# Altium project atfc.PrjPcb (part 2 of 2)

## Sheet Regulators.SchDoc: Power: Regulators
size A4; Engineer: Samer Kilani; DocumentNumber: 8; SheetNumber: 8; SheetTotal: 9
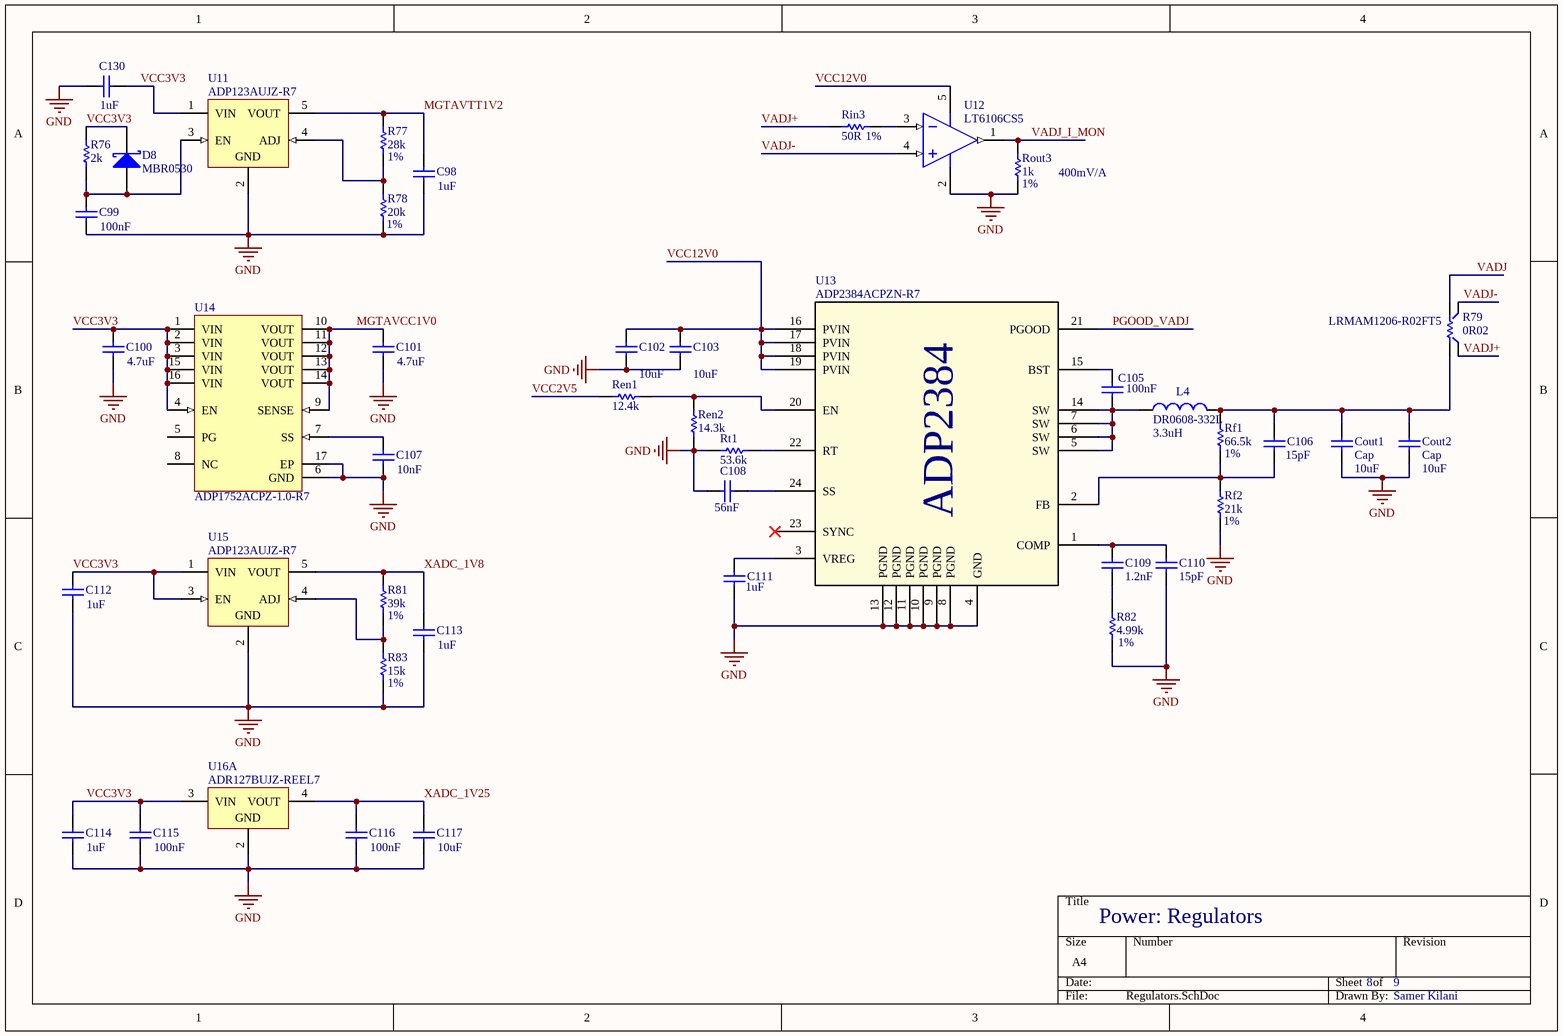
[diagram p7: Regulators.SchDoc]

### Parts
C98  value 1uF  [C0603]
C99  value 100nF  [C0402]
C100  value 4.7uF  [C0603]
C101  value 4.7uF  [C0603]
C102  value 10uF  [C0805]
C103  value 10uF  [C0805]
C105  value 100nF  [C0402]  (hidden comment: Cap)
C106  value 15pF  [C0402]
C107  value 10nF  [C0603]
C108  value 56nF  [C0402]
C109  value 1.2nF  [C0402]
C110  value 15pF  [C0402]
C111  value 1uF  [C0402]
C112  value 1uF  [C0603]
C113  value 1uF  [C0603]
C114  value 1uF  [C0603]
C115  value 100nF  [C0402]
C116  value 100nF  [C0402]
C117  value 10uF  [C0603]
C130  value 1uF  [C0603]
Cout1  Cap  value 10uF  [C0805]
Cout2  Cap  value 10uF  [C0805]
D8  MBR0530  [SOD-123]
L4  DR0608-332L  value 3.3uH  [DR0608]
R76  value 2k  [R0402]  (hidden comment: Res)
R77  value 28k  Tolerance: 1%  [R0402]  (hidden comment: Res)
R78  value 20k  Tolerance: 1%  [R0402]  (hidden comment: Res)
R79  LRMAM1206-R02FT5  value 0R02  [LRMA1206]  (net tie)
R81  value 39k  Tolerance: 1%  [R0603]  (hidden comment: Res)
R82  value 4.99k  Tolerance: 1%  [R0402]  (hidden comment: Res)
R83  value 15k  Tolerance: 1%  [R0603]  (hidden comment: Res)
Ren1  value 12.4k  [R0402]  (hidden comment: Res)
Ren2  value 14.3k  [R0402]  (hidden comment: Res)
Rf1  value 66.5k  Tolerance: 1%  [R0402]  (hidden comment: Res)
Rf2  value 21k  Tolerance: 1%  [R0402]  (hidden comment: Res)
Rin3  value 50R  Tolerance: 1%  [R0402]  (hidden comment: Res)
Rout3  value 1k  Tolerance: 1%  [R0402]  (hidden comment: Res)
Rt1  value 53.6k  [R0402]  (hidden comment: Res)
U11  ADP123AUJZ-R7  [ADI-UJ-5_N]
U12  LT6106CS5  [LT-S5-5-TSOT-23_N]
U13  ADP2384ACPZN-R7  [CP_24_12]
U14  ADP1752ACPZ-1.0-R7  [CP-16-4_N]
U15  ADP123AUJZ-R7  [ADI-UJ-5_N]
U16  ADR127BUJZ-REEL7  [ADI-UJ-6_N]  (part A of 2)

### Nets
GND: C98.2 C99.2 C100.2 C101.2 C102.2 C103.2 C107.2 C108.2 C110.2 C111.1 C112.2 C113.2 C114.2 C115.2 C116.2 C117.2 C130.1 Cout1.1 Cout2.1 R78.1 R82.1 R83.1 Ren2.1 Rf2.1 Rout3.1 Rt1.1 U11.2(GND) U12.2(V-) U13.4(GND) U13.8(PGND) U13.9(PGND) U13.10(PGND) U13.11(PGND) U13.12(PGND) U13.13(PGND) U14.6(GND) U14.17(EP) U15.2(GND) U16.2(GND)
MGTAVCC1V0: C101.1 U14.9(SENSE) U14.10(VOUT) U14.11(VOUT) U14.12(VOUT) U14.13(VOUT) U14.14(VOUT)
MGTAVTT1V2: C98.1 R77.2 U11.5(VOUT)
PGOOD_VADJ: U13.21(PGOOD)
VADJ: R79.2
VADJ+: R79.3 Rin3.1
VADJ-: R79.4 U12.4(+IN)
VADJ_I_MON: Rout3.2 U12.1(OUT)
VCC2V5: Ren1.1
VCC3V3: C100.1 C112.1 C114.1 C115.1 C130.2 D8.1(K) R76.2 U11.1(VIN) U14.1(VIN) U14.2(VIN) U14.3(VIN) U14.4(EN) U14.15(VIN) U14.16(VIN) U15.1(VIN) U15.3(EN) U16.3(VIN)
VCC12V0: C102.1 C103.1 U12.5(V+) U13.16(PVIN) U13.17(PVIN) U13.18(PVIN) U13.19(PVIN)
XADC_1V8: C113.1 R81.2 U15.5(VOUT)
XADC_1V25: C116.1 C117.1 U16.4(VOUT)
NetC99_1: C99.1 D8.2(A) R76.1 U11.3(EN)
NetC105_1: C105.1 L4.1 U13.5(SW) U13.6(SW) U13.7(SW) U13.14(SW)
NetC105_2: C105.2 U13.15(BST)
NetC106_1: C106.1 Cout1.2 Cout2.2 L4.2 R79.1 Rf1.2
NetC106_2: C106.2 Rf1.1 Rf2.2 U13.2(FB)
NetC107_1: C107.1 U14.7(SS)
NetC108_1: C108.1 U13.24(SS)
NetC109_1: C109.1 C110.1 U13.1(COMP)
NetC109_2: C109.2 R82.2
NetC111_2: C111.2 U13.3(VREG)
NetR77_1: R77.1 R78.2 U11.4(ADJ)
NetR81_1: R81.1 R83.2 U15.4(ADJ)
NetRen1_2: Ren1.2 Ren2.2 U13.20(EN)
NetRin3_2: Rin3.2 U12.3(-IN)
NetRt1_2: Rt1.2 U13.22(RT)

Not connected (* = marked no-connect by the designer): U13 23(SYNC)*; U14 5(PG) 8(NC)

### Notes on the sheet
- (near Rout3) 400mV/A
- (near U13) ADP2384

### Library data of the parts
C98-C103 C105-C117 C130 Cout1 Cout2 = Cap: Capacitor; Published: 8-Jun-2000; LatestRevisionDate: 17-Jul-2002; LatestRevisionNote: Re-released for DXP Platform.; PackageReference: RAD-0.3; Publisher: Altium Limited; PackageDescription: Radial Cap, Thru-Hole; 2 Leads; 0.3 in Pin Spacing
L4 = Inductor: Code_IEC: 1005; Published: 8-Jun-2000; LatestRevisionDate: 29-May-2009; LatestRevisionNote: IPC-7351 Footprint Added.; PackageReference: 0402-A; Publisher: Altium Limited; PackageDescription: Chip Inductor; Code_JEITA: 0402
R76-R78 R81-R83 Ren1 Ren2 Rf1 Rf2 Rin3 Rout3 Rt1 = Res: Resistor
R79 = Res_sense: Resistor
U11 U15 = ADP123AUJZ-R7: 300 mA, Low Quiescent Current, CMOS Linear Regulator, 2.3 to 5.5 V Vin, 0.8 to 5 V Vout, Industrial, 5-pin SOT23 (UJ-5), Reel; Manufacturer: Analog Devices; Iout max: 300mA; Supply Current IGND @ Small Load: 45uA; Vin (max) (V): 5.5; Vin (min) (V): 2.3; Vout Adjustable Range: 0.8V to 5V; DatasheetVersion: Rev. E; PackageVersion: 100708-A, 10/2008; PackageReference: UJ-5; PackageDescription: 5-Pin Thin Small Outline Transistor Package, Body 2.9 x 1.6 mm, Pitch 0.95 mm; Supplier 1: Digi-Key; Supplier Part Number 1: ADP123AUJZ-R7TR-ND; Supplier 2: Digi-Key; Supplier Part Number 2: ADP123AUJZ-R7CT-ND; Supplier 3: Digi-Key; Supplier Part Number 3: ADP123AUJZ-R7DKR-ND; Supplier 4: Farnell; Supplier Part Number 4: 2296039; Supplier 5: Newark; Supplier Part Number 5: 12T2968; Supplier 6: Newark; Supplier Part Number 6: 52R8082; Supplier 7: Mouser; Supplier Part Number 7: 584-ADP123AUJZ-R7; Packing: Reel; Mounting Technology: Surface Mount; Code_JEDEC: MO-193-AB; PartNumber: ADP123AUJZ-R7; ComponentLink1Description: Manufacturer URL; ComponentLink1URL: http://www.analog.com/en/index.html; ComponentLink2Description: Datasheet; ComponentLink2URL: http://www.analog.com/static/imported-files/data_sheets/ADP122_123.pdf; ComponentLink3Description: Package Specification; ComponentLink3URL: http:/www.analog.com/static/imported-files/packages/PKG_PDF/TSOT(UJ)/UJ_5.pdf; ComponentLink4Description: URL Link1; ComponentLink4URL: Product URL:http://www.analog.com/en/ADP123/productSearch.html
U12 = LT6106CS5: Single Channel, Low Cost, High Side Current Sense Operational Amplifier, 0.2 MHz Typical GBW, 5-Pin SOT-23 (S5-5), Commercial; Linear Technology Part Number: LT6106; Manufacturer: Linear Technology; Channels (#): 1; GBW (MHz) Typical: 0.2; Is (mA) Typical: 0.06; Vos (mV) Guaranteed: 0.25; Vos (mV) Typical: 0.15; Vs Max (V): 36; Vs Min (V): 2.7; DatasheetVersion: Rev. A; PackageReference: LT-S5-5-TSOT-23; PackageDescription: 5-Lead Plastic TSOT-23, Body 1.63 x 2.90 mm, Pitch 0.95 mm; Type: CSA; Mounting Technology: Surface Mount; Code_JEDEC: MO-193; PartNumber: LT6106CS5; ComponentLink1Description: Manufacturer URL; ComponentLink1URL: http://www.linear.com/; ComponentLink2Description: Datasheet; ComponentLink2URL: http://cds.linear.com/docs/en/datasheet/6106fa.pdf; ComponentLink3Description: Package Specification; ComponentLink3URL: http://cds.linear.com/docs/en/packaging/SOT_5_05-08-1635.pdf
U13 = ADP2384ACPZN-R7: Imported; Value: Value; Type: Type; RefDes: RefDes
U14 = ADP1752ACPZ-1.0-R7: 0.8 A, Low VIN, Low Dropout Linear Regulator, 1.6 to 3.6 V Vin, 1 V Vout, Industrial, 16-pin QFN (CP-16-4), Reel; Manufacturer: Analog Devices; Iout max: 800mA; Preset Vout Values (V): 1; Supply Current IGND @ Small Load: 90uA; Vin (max) (V): 3.6; Vin (min) (V): 1.6; DatasheetVersion: Rev. D; PackageVersion: 010606-0, 01/2006; PackageReference: CP-16-4; PackageDescription: 16-Pin Lead Frame Chip Scale Package, Body 4 x 4 mm, Pitch 0.65 mm; Supplier 1: Digi-Key; Supplier Part Number 1: ADP1752ACPZ-1.0-R7TR-ND; Supplier 2: Digi-Key; Supplier Part Number 2: ADP1752ACPZ-1.0-R7CT-ND; Supplier 3: Digi-Key; Supplier Part Number 3: ADP1752ACPZ-1.0-R7DKR-ND; Supplier 4: Mouser; Supplier Part Number 4: 584-ADP1752ACPZ1.0R7; Packing: Reel; Mounting Technology: Surface Mount; Code_JEDEC: MO-220-VGGC; PartNumber: ADP1752ACPZ-1.0-R7; ComponentLink1Description: Manufacturer URL; ComponentLink1URL: http://www.analog.com/en/index.html; ComponentLink2Description: Datasheet; ComponentLink2URL: http://www.analog.com/static/imported-files/data_sheets/ADP1752_1753.pdf; ComponentLink3Description: Package Specification; ComponentLink3URL: http://www.analog.com/static/imported-files/packages/46009454504174339653421710019CP_16_4.pdf; ComponentLink4Description: URL Link1; ComponentLink4URL: Product URL:http://www.analog.com/en/ADP1752/productSearch.html
U16 = ADR127BUJZ-REEL7: Precision, Micropower LDO Voltage Reference in TSOT, 1.25 V Output, 2.7 to 18 V Supply, Industrial, 6-pin SOT23 (UJ-6), Reel; Manufacturer: Analog Devices; Max V Supply (V): 18; Min V Supply (V): 2.7; Ref Out TC (ppm/C): 3; Vout: 1.25V; DatasheetVersion: Rev. B; PackageVersion: Dec-04; PackageReference: UJ-6; PackageDescription: 6-Pin Thin Small Outline Transistor Package, Body 2.9 x 1.6 mm, Pitch 0.95 mm; Supplier 1: Digi-Key; Supplier Part Number 1: ADR127BUJZ-REEL7TR-ND; Supplier 2: Digi-Key; Supplier Part Number 2: ADR127BUJZ-REEL7CT-ND; Supplier 3: Digi-Key; Supplier Part Number 3: ADR127BUJZ-REEL7DKR-ND; Supplier 4: Farnell; Supplier Part Number 4: 2312969; Supplier 5: Mouser; Supplier Part Number 5: 584-ADR127BUJZ-R7; Packing: Reel; Operating Temp Range: -40 to 125 degC; Mounting Technology: Surface Mount; Code_JEDEC: MO-193-AA; PartNumber: ADR127BUJZ-REEL7; ComponentLink1Description: Manufacturer URL; ComponentLink1URL: http://www.analog.com/en/index.html; ComponentLink2Description: Datasheet; ComponentLink2URL: http://www.analog.com/static/imported-files/data_sheets/ADR121_125_127.pdf; ComponentLink3Description: Package Specification; ComponentLink3URL: http://www.analog.com/static/imported-files/packages/PKG_PDF/TSOT(UJ)/UJ_6.pdf; ComponentLink4Description: URL Link1; ComponentLink4URL: Product URL:http://www.analog.com/en/special-linear-functions/voltage-references/adr127/products/product.html

## Sheet Config.SchDoc: FPGA Configuration
size A4; Engineer: Samer Kilani; DocumentNumber: 9; SheetNumber: 9; SheetTotal: 9
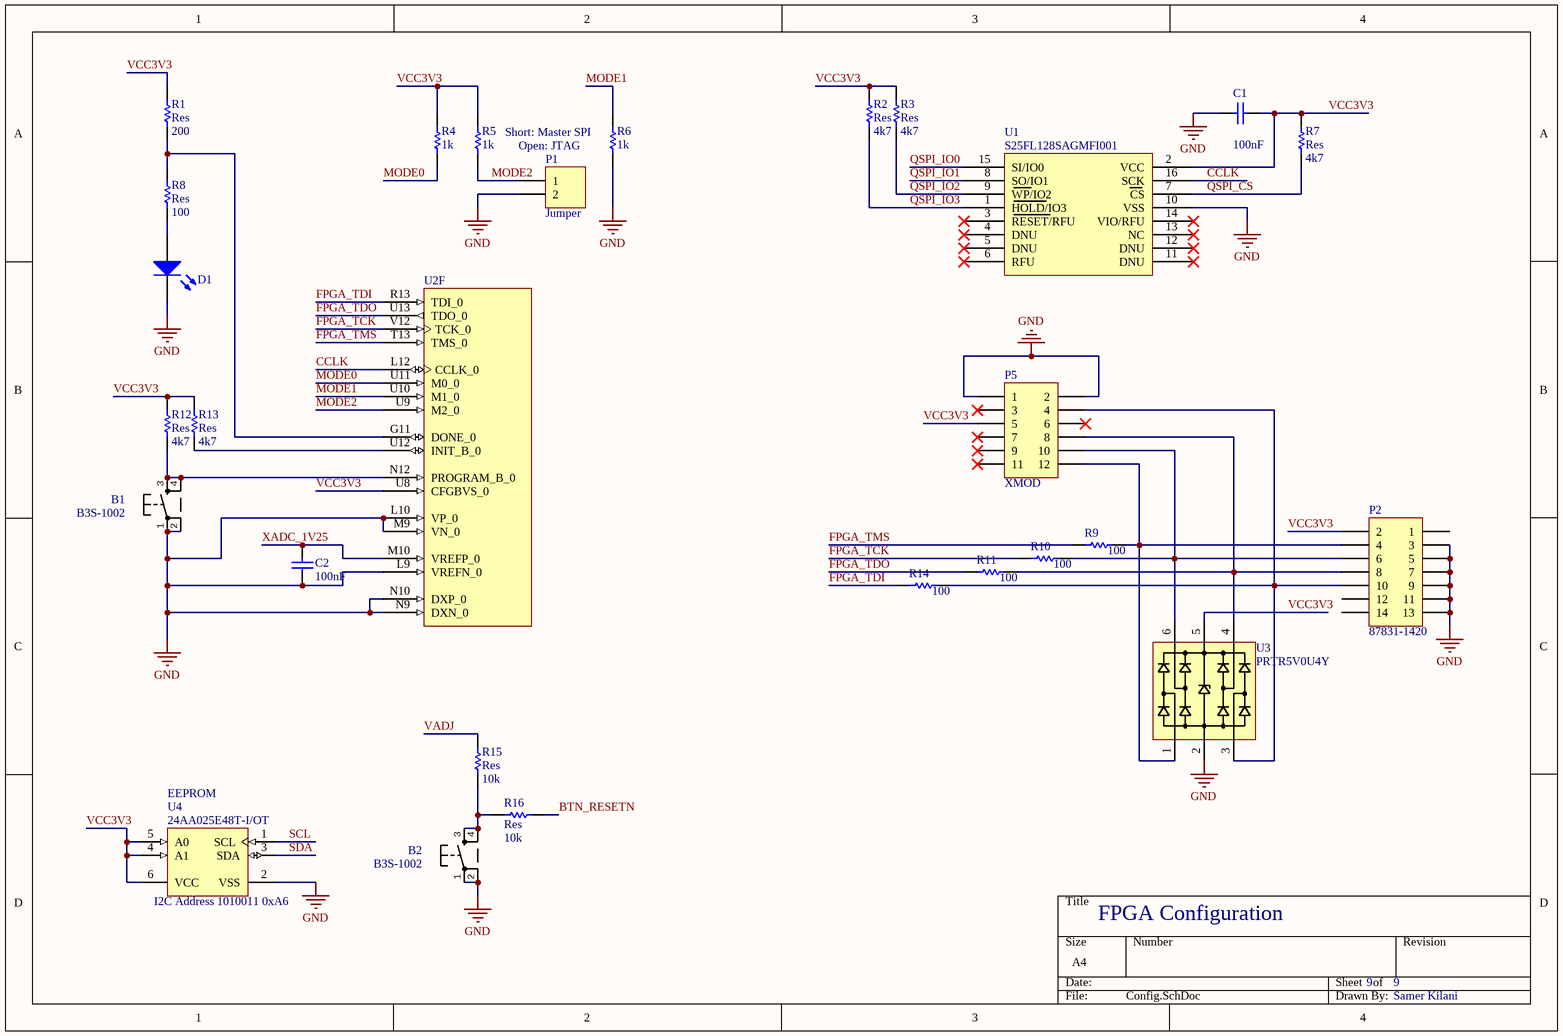
[diagram p8: Config.SchDoc]

### Parts
B1  B3S-1002  [B3S-1002]
B2  B3S-1002  [B3S-1002]
C1  value 100nF  [C0603]  (hidden comment: Cap)
C2  value 100nF  [C0402]  (hidden comment: Cap)
D1  KPT-1608EC  [KP-1608QBC-D]  (value not drawn)
P1  Jumper  [HDR1X2]
P2  87831-1420  [87831-1420]
P5  XMOD  [HDR2X6]
R1  Res  value 200  [R0603]
R2  Res  value 4k7  [R0603]
R3  Res  value 4k7  [R0603]
R4  value 1k  [R0402]  (hidden comment: Res)
R5  value 1k  [R0402]  (hidden comment: Res)
R6  value 1k  [R0402]  (hidden comment: Res)
R7  Res  value 4k7  [R0603]
R8  Res  value 100  [R0603]
R9  value 100  [R0402]  (hidden comment: Res)
R10  value 100  [R0402]  (hidden comment: Res)
R11  value 100  [R0402]  (hidden comment: Res)
R12  Res  value 4k7  [R0603]
R13  Res  value 4k7  [R0402]
R14  value 100  [R0402]  (hidden comment: Res)
R15  Res  value 10k  [R0603]
R16  Res  value 10k  [R0603]
U1  S25FL128SAGMFI001  [SOIC16]
U2  (no value)  [FGG484]  (part F of 12)
U3  PRTR5V0U4Y  [SOT363]
U4  24AA025E48T-I/OT  [MCHP-SOT-23-OT6_N]

### Nets
GND: B1.1 B1.2 B2.1 B2.2 C1.1 C2.1 D1.2(K) P1.2 P2.3 P2.5 P2.7 P2.9 P2.11 P2.13 P5.1 P5.2 R6.1 U1.10(VSS) U2.L9(VREFN_0) U2.L10(VP_0) U2.M9(VN_0) U2.N9(DXN_0) U2.N10(DXP_0) U3.2 U4.2(VSS)
BTN_RESETN: R16.1
CCLK: U1.16(SCK) U2.L12(CCLK_0)
FPGA_TCK: R10.1 U2.V12(TCK_0)
FPGA_TDI: R14.1 U2.R13(TDI_0)
FPGA_TDO: R11.1 U2.U13(TDO_0)
FPGA_TMS: R9.1 U2.T13(TMS_0)
MODE0: R4.1 U2.U11(M0_0)
MODE1: R6.2 U2.U10(M1_0)
MODE2: P1.1 R5.1 U2.U9(M2_0)
QSPI_CS: R7.1 U1.7(CS)
QSPI_IO0: U1.15(SI/IO0)
QSPI_IO1: U1.8(SO/IO1)
QSPI_IO2: R3.1 U1.9(WP/IO2)
QSPI_IO3: R2.1 U1.1(HOLD/IO3)
SCL: U4.1(SCL)
SDA: U4.3(SDA)
VADJ: R15.2
VCC3V3: C1.2 P2.2 P5.5 R1.2 R2.2 R3.2 R4.2 R5.2 R7.2 R12.2 R13.2 U1.2(VCC) U2.U8(CFGBVS_0) U3.5 U4.4(A1) U4.5(A0) U4.6(VCC)
XADC_1V25: C2.2 U2.M10(VREFP_0)
NetB1_3: B1.3 B1.4 R12.1 U2.N12(PROGRAM_B_0)
NetB2_3: B2.3 B2.4 R15.1 R16.2
NetD1_1: D1.1(A) R8.1
NetP2_4: P2.4 P5.12 R9.2 U3.1
NetP2_6: P2.6 P5.10 R10.2 U3.6
NetP2_8: P2.8 P5.8 R11.2 U3.4
NetP2_10: P2.10 P5.4 R14.2 U3.3
NetR1_1: R1.1 R8.2 U2.G11(DONE_0)
NetR13_1: R13.1 U2.U12(INIT_B_0)

Not connected (* = marked no-connect by the designer): P2 1 12 14; P5 3* 6* 7* 9* 11*; U1 3(RESET/RFU)* 4(DNU)* 5(DNU)* 6(RFU)* 11(DNU)* 12(DNU)* 13(NC)* 14(VIO/RFU)*

### Notes on the sheet
- (near R6) Short: Master SPI
- Open: JTAG
- (near U4) EEPROM
- (near U4) I2C Address 1010011 0xA6

### Library data of the parts
B1 B2 = TS42: PartNo: B3S-1002
C1 C2 = Cap: Capacitor; Published: 8-Jun-2000; LatestRevisionDate: 17-Jul-2002; LatestRevisionNote: Re-released for DXP Platform.; PackageReference: RAD-0.3; Publisher: Altium Limited; PackageDescription: Radial Cap, Thru-Hole; 2 Leads; 0.3 in Pin Spacing
D1 = LED: Published: 8-Jun-2000; LatestRevisionDate: 08-Jul-2005; LatestRevisionNote: Mech Layer 1 removed.; PackageReference: LED-0; Publisher: Altium Limited; PackageDescription: LED; 2 Leads
P1 = Header 2: Header, 2-Pin; LatestRevisionDate: 17-Jul-2002; LatestRevisionNote: Re-released for DXP Platform.; Publisher: Altium Limited
P2 = Header 7X2: Header, 7-Pin, Dual row; LatestRevisionDate: 17-Jul-2002; LatestRevisionNote: Re-released for DXP Platform.; Publisher: Altium Limited
P5 = Header 6X2: Header, 6-Pin, Dual row; LatestRevisionDate: 17-Jul-2002; LatestRevisionNote: Re-released for DXP Platform.; Publisher: Altium Limited
R1-R16 = Res: Resistor
U2 = XC7A35T-1FGG484C: Artix-7 FPGA, 250 User I/Os, 4 GTP, 484-Ball BGA, Speed Grade 1, Commercial Grade, Pb-Free; Manufacturer: Xilinx; Total Block RAM: 1800 Kb; GTP: 4; Clock Mgmt Tiles (CMTs): 5; Logic Cells: 33280; Available User I/O: 250; Speed Grades: 1; DatasheetVersion: v1.15; PackageVersion: Rev. 1.11; PackageReference: FGG484; PackageDescription: 484-Ball Wire-Bond Fine-Pitch BGA, Body 23 x 23 mm, Pitch 1 mm; Maximum Distributed RAM: 400 Kb; Operating Temperature Range: Commercial; NexusDeviceID: XC7A35T-1FGG484C; Mounting Technology: Surface Mount; PartNumber: XC7A35T-1FGG484C; ComponentLink1Description: Manufacturer URL; ComponentLink1URL: http://www.xilinx.com/; ComponentLink2Description: Datasheet; ComponentLink2URL: http://www.xilinx.com/support/documentation/data_sheets/ds180_7Series_Overview.pdf; ComponentLink3Description: Package Specification; ComponentLink3URL: http://www.xilinx.com/support/documentation/user_guides/ug475_7Series_Pkg_Pinout.pdf; ComponentLink4Description: DC and Switching Characteristics; ComponentLink4URL: http://www.xilinx.com/support/documentation/data_sheets/ds181_Artix_7_Data_Sheet.pdf; ComponentLink5Description: Package File; ComponentLink5URL: http://www.xilinx.com/support/packagefiles/a7packages/xc7a200tsbg484pkg.txt; ComponentLink6Description: Packaging and Pinout; ComponentLink6URL: http://www.xilinx.com/support/documentation/user_guides/ug475_7Series_Pkg_Pinout.pdf
U4 = 24AA025E48T-I/OT: 2K bits I2C™ Serial EEPROM with EUI-48™ Node Identity, 1.7 to 5.5 V, 400 kHz, -40 to 85 degC, 6-pin SOT-23 (OT6), Tape and Reel; Manufacturer: Microchip; DatasheetVersion: Rev. D; PackageVersion: C04-028B; PackageReference: SOT-23-OT6; PackageDescription: 6-Lead Plastic Small Outline Transistor, 2.9 x 1.55 mm Body, 0.95 mm Pitch; Supplier 1: Digi-Key; Supplier Part Number 1: 24AA025E48T-I/OTTR-ND; Supplier 2: Digi-Key; Supplier Part Number 2: 24AA025E48T-I/OTCT-ND; Supplier 3: Digi-Key; Supplier Part Number 3: 24AA025E48T-I/OTDKR-ND; Supplier 4: Farnell; Supplier Part Number 4: 1814891RL; Supplier 5: Farnell; Supplier Part Number 5: 1814891; Supplier 6: Newark; Supplier Part Number 6: 74R6951; Supplier 7: Newark; Supplier Part Number 7: 73R8708; Supplier 8: Mouser; Supplier Part Number 8: 579-24AA025E48T-I/OT; Mounting Technology: Surface Mount; PartNumber: 24AA025E48T-I/OT; ComponentLink1Description: Manufacturer URL; ComponentLink1URL: http://www.microchip.com; ComponentLink2Description: Datasheet; ComponentLink2URL: http://ww1.microchip.com/downloads/en/DeviceDoc/22124D.pdf; ComponentLink3Description: Package Specification; ComponentLink3URL: http://www.microchip.com/stellent/groups/techpub_sg/documents/packagingspec/en012702.pdf; ComponentLink4Description: Product URL; ComponentLink4URL: http://www.microchip.com/24AA025E48

## Nets that join several sheets
GND: PWR_APD5052 (54 pins), FPGA_PWR (144 pins), SFP (43 pins), IO (16 pins), FMC (64 pins), FPGA_Banks1 (6 pins), FPGA_Banks2 (6 pins), Regulators (39 pins), Config (25 pins)
3V3_I_MON: PWR_APD5052 (Rout2.2 U10.1), FPGA_Banks1 (U2.H14)
12V0_I_MON: PWR_APD5052 (Rout1.2 U9.1), FPGA_Banks1 (U2.H15)
BTN_RESETN: FPGA_Banks2 (U2.Y2), Config (R16.1)
DIP1: IO (R48.1 S1.1), FPGA_Banks1 (U2.AA18)
DIP2: IO (R49.1 S1.2), FPGA_Banks1 (U2.AA19)
DIP3: IO (R50.1 S1.3), FPGA_Banks1 (U2.AA20)
DIP4: IO (R51.1 S1.4), FPGA_Banks1 (U2.AA21)
FMC_CLK0_M2C_N: FMC (J1.H5), FPGA_Banks2 (U2.W4)
FMC_CLK0_M2C_P: FMC (J1.H4), FPGA_Banks2 (U2.V4)
FMC_CLK1_M2C_N: FMC (J1.G3), FPGA_Banks2 (U2.T4)
FMC_CLK1_M2C_P: FMC (J1.G2), FPGA_Banks2 (U2.R4)
FMC_LA00_CC_N: FMC (J1.G7), FPGA_Banks2 (U2.U5)
FMC_LA00_CC_P: FMC (J1.G6), FPGA_Banks2 (U2.T5)
FMC_LA01_CC_N: FMC (J1.D9), FPGA_Banks2 (U2.AA4)
FMC_LA01_CC_P: FMC (J1.D8), FPGA_Banks2 (U2.Y4)
FMC_LA02_N: FMC (J1.H8), FPGA_Banks2 (U2.K3)
FMC_LA02_P: FMC (J1.H7), FPGA_Banks2 (U2.L3)
FMC_LA03_N: FMC (J1.G10), FPGA_Banks2 (U2.G2)
FMC_LA03_P: FMC (J1.G9), FPGA_Banks2 (U2.H2)
FMC_LA04_N: FMC (J1.H11), FPGA_Banks2 (U2.AB1)
FMC_LA04_P: FMC (J1.H10), FPGA_Banks2 (U2.AA1)
FMC_LA05_N: FMC (J1.D12), FPGA_Banks2 (U2.M2)
FMC_LA05_P: FMC (J1.D11), FPGA_Banks2 (U2.M3)
FMC_LA06_N: FMC (J1.C11), FPGA_Banks2 (U2.AB2)
FMC_LA06_P: FMC (J1.C10), FPGA_Banks2 (U2.AB3)
FMC_LA07_N: FMC (J1.H14), FPGA_Banks2 (U2.Y1)
FMC_LA07_P: FMC (J1.H13), FPGA_Banks2 (U2.W1)
FMC_LA08_N: FMC (J1.G13), FPGA_Banks2 (U2.J2)
FMC_LA08_P: FMC (J1.G12), FPGA_Banks2 (U2.K2)
FMC_LA09_N: FMC (J1.D15), FPGA_Banks2 (U2.R2)
FMC_LA09_P: FMC (J1.D14), FPGA_Banks2 (U2.R3)
FMC_LA10_N: FMC (J1.C15), FPGA_Banks2 (U2.AB5)
FMC_LA10_P: FMC (J1.C14), FPGA_Banks2 (U2.AA5)
FMC_LA11_N: FMC (J1.H17), FPGA_Banks2 (U2.U1)
FMC_LA11_P: FMC (J1.H16), FPGA_Banks2 (U2.T1)
FMC_LA12_N: FMC (J1.G16), FPGA_Banks2 (U2.N3)
FMC_LA12_P: FMC (J1.G15), FPGA_Banks2 (U2.N4)
FMC_LA13_N: FMC (J1.D18), FPGA_Banks2 (U2.AA3)
FMC_LA13_P: FMC (J1.D17), FPGA_Banks2 (U2.Y3)
FMC_LA14_N: FMC (J1.C19), FPGA_Banks2 (U2.AB6)
FMC_LA14_P: FMC (J1.C18), FPGA_Banks2 (U2.AB7)
FMC_LA15_N: FMC (J1.H20), FPGA_Banks2 (U2.P1)
FMC_LA15_P: FMC (J1.H19), FPGA_Banks2 (U2.R1)
FMC_LA16_N: FMC (J1.G19), FPGA_Banks2 (U2.V2)
FMC_LA16_P: FMC (J1.G18), FPGA_Banks2 (U2.U2)
FMC_LA17_CC_N: FMC (J1.D21), FPGA_Banks2 (U2.G4)
FMC_LA17_CC_P: FMC (J1.D20), FPGA_Banks2 (U2.H4)
FMC_LA18_CC_N: FMC (J1.C23), FPGA_Banks2 (U2.J4)
FMC_LA18_CC_P: FMC (J1.C22), FPGA_Banks2 (U2.K4)
FMC_LA19_N: FMC (J1.H23), FPGA_Banks2 (U2.L1)
FMC_LA19_P: FMC (J1.H22), FPGA_Banks2 (U2.M1)
FMC_LA20_N: FMC (J1.G22), FPGA_Banks2 (U2.W5)
FMC_LA20_P: FMC (J1.G21), FPGA_Banks2 (U2.W6)
FMC_LA21_N: FMC (J1.H26), FPGA_Banks2 (U2.J1)
FMC_LA21_P: FMC (J1.H25), FPGA_Banks2 (U2.K1)
FMC_LA22_N: FMC (J1.G25), FPGA_Banks2 (U2.AA6)
FMC_LA22_P: FMC (J1.G24), FPGA_Banks2 (U2.Y6)
FMC_LA23_N: FMC (J1.D24), FPGA_Banks2 (U2.V5)
FMC_LA23_P: FMC (J1.D23), FPGA_Banks2 (U2.U6)
FMC_LA24_N: FMC (J1.H29), FPGA_Banks2 (U2.F1)
FMC_LA24_P: FMC (J1.H28), FPGA_Banks2 (U2.G1)
FMC_LA25_N: FMC (J1.G28), FPGA_Banks2 (U2.Y9)
FMC_LA25_P: FMC (J1.G27), FPGA_Banks2 (U2.W9)
FMC_LA26_N: FMC (J1.D27), FPGA_Banks2 (U2.W7)
FMC_LA26_P: FMC (J1.D26), FPGA_Banks2 (U2.V7)
FMC_LA27_N: FMC (J1.C27), FPGA_Banks2 (U2.AB8)
FMC_LA27_P: FMC (J1.C26), FPGA_Banks2 (U2.AA8)
FMC_LA28_N: FMC (J1.H32), FPGA_Banks2 (U2.B2)
FMC_LA28_P: FMC (J1.H31), FPGA_Banks2 (U2.C2)
FMC_LA29_N: FMC (J1.G31), FPGA_Banks2 (U2.V8)
FMC_LA29_P: FMC (J1.G30), FPGA_Banks2 (U2.V9)
FMC_LA30_N: FMC (J1.H35), FPGA_Banks2 (U2.D1)
FMC_LA30_P: FMC (J1.H34), FPGA_Banks2 (U2.E1)
FMC_LA31_N: FMC (J1.G34), FPGA_Banks2 (U2.L4)
FMC_LA31_P: FMC (J1.G33), FPGA_Banks2 (U2.L5)
FMC_LA32_N: FMC (J1.H38), FPGA_Banks2 (U2.A1)
FMC_LA32_P: FMC (J1.H37), FPGA_Banks2 (U2.B1)
FMC_LA33_N: FMC (J1.G37), FPGA_Banks2 (U2.T6)
FMC_LA33_P: FMC (J1.G36), FPGA_Banks2 (U2.R6)
FMC_MGT_C2M_N: FMC (J1.C3), FPGA_Banks2 (U2.C7)
FMC_MGT_C2M_P: FMC (J1.C2), FPGA_Banks2 (U2.D7)
FMC_MGT_CLK_N: FMC (C4.2), FPGA_Banks2 (U2.E10)
FMC_MGT_CLK_P: FMC (C3.2), FPGA_Banks2 (U2.F10)
FMC_MGT_M2C_N: FMC (J1.C7), FPGA_Banks2 (U2.C9)
FMC_MGT_M2C_P: FMC (J1.C6), FPGA_Banks2 (U2.D9)
FZ1: FPGA_PWR (5 pins), FPGA_Banks2 (35 pins)
LED0: IO (R42.2), FPGA_Banks1 (U2.F21)
LED1: IO (R43.2), FPGA_Banks1 (U2.F20)
MGTAVCC1V0: FPGA_PWR (8 pins), FPGA_Banks1 (R33.2), Regulators (7 pins)
MGTAVTT1V2: FPGA_PWR (9 pins), FPGA_Banks1 (R31.2), FPGA_Banks2 (R37.1), Regulators (C98.1 R77.2 U11.5)
PGOOD: PWR_APD5052 (R75.1 U8.20), IO (Q1.5), FPGA_Banks1 (R21.2)
PGOOD_VADJ: IO (Q1.2), FMC (J1.D1 R17.1), FPGA_Banks1 (R22.2), Regulators (U13.21)
PMODA1_N: IO (R98.1), FPGA_Banks1 (U2.D22)
PMODA1_P: IO (R80.1), FPGA_Banks1 (U2.E22)
PMODA2_N: IO (R102.1), FPGA_Banks1 (U2.H22)
PMODA2_P: IO (R100.1), FPGA_Banks1 (U2.J22)
PMODA3_N: IO (R99.2), FPGA_Banks1 (U2.B22)
PMODA3_P: IO (R97.2), FPGA_Banks1 (U2.C22)
PMODA4_N: IO (R103.2), FPGA_Banks1 (U2.G22)
PMODA4_P: IO (R101.2), FPGA_Banks1 (U2.G21)
PMODB1_N: IO (R106.1), FPGA_Banks1 (U2.C20)
PMODB1_P: IO (R104.1), FPGA_Banks1 (U2.D20)
PMODB2_N: IO (R110.1), FPGA_Banks1 (U2.E14)
PMODB2_P: IO (R108.1), FPGA_Banks1 (U2.E13)
PMODB3_N: IO (R107.2), FPGA_Banks1 (U2.D15)
PMODB3_P: IO (R105.2), FPGA_Banks1 (U2.D14)
PMODB4_N: IO (R111.2), FPGA_Banks1 (U2.D16)
PMODB4_P: IO (R109.2), FPGA_Banks1 (U2.E16)
PRESNT_M2C_L: FMC (J1.H2 R18.1), FPGA_Banks1 (R96.1)
QSPI_CS: FPGA_Banks1 (U2.T19), Config (R7.1 U1.7)
QSPI_IO0: FPGA_Banks1 (U2.P22), Config (U1.15)
QSPI_IO1: FPGA_Banks1 (U2.R22), Config (U1.8)
QSPI_IO2: FPGA_Banks1 (U2.P21), Config (R3.1 U1.9)
QSPI_IO3: FPGA_Banks1 (U2.R21), Config (R2.1 U1.1)
RGB_B1: IO (R38.2), FPGA_Banks1 (U2.C13)
RGB_B2: IO (R40.2), FPGA_Banks1 (U2.C17)
RGB_G1: IO (R39.2), FPGA_Banks1 (U2.C14)
RGB_G2: IO (R41.2), FPGA_Banks1 (U2.C18)
RGB_R1: IO (R44.1), FPGA_Banks1 (U2.C15)
RGB_R2: IO (R45.1), FPGA_Banks1 (U2.C19)
SCL: FMC (J1.C30), FPGA_Banks1 (R35.2 U2.AB21), Config (U4.1)
SDA: FMC (J1.C31), FPGA_Banks1 (R36.2 U2.AB22), Config (U4.3)
SFP1_LOS: SFP (J3.8 R84.2), FPGA_Banks1 (U2.B17)
SFP1_MOD_ABS: SFP (J3.6 R87.2), FPGA_Banks1 (U2.A13)
SFP1_RD_N: SFP (J4.12), FPGA_Banks2 (U2.A8)
SFP1_RD_P: SFP (J4.13), FPGA_Banks2 (U2.B8)
SFP1_SCL: SFP (J3.5 R88.2), FPGA_Banks1 (U2.A16)
SFP1_SDA: SFP (J3.4 R89.2), FPGA_Banks1 (U2.B15)
SFP1_TD_N: SFP (J4.19), FPGA_Banks2 (U2.A4)
SFP1_TD_P: SFP (J4.18), FPGA_Banks2 (U2.B4)
SFP1_TX_EN: SFP (J3.3 R86.2), FPGA_Banks1 (U2.A14)
SFP1_TX_FAULT: SFP (J3.2 R85.2), FPGA_Banks1 (U2.A15)
SFP2_LOS: SFP (J4.8 R90.2), FPGA_Banks1 (U2.B21)
SFP2_MOD_ABS: SFP (J4.6 R93.2), FPGA_Banks1 (U2.A18)
SFP2_RD_N: SFP (J3.12), FPGA_Banks2 (U2.A10)
SFP2_RD_P: SFP (J3.13), FPGA_Banks2 (U2.B10)
SFP2_SCL: SFP (J4.5 R94.2), FPGA_Banks1 (U2.A21)
SFP2_SDA: SFP (J4.4 R95.2), FPGA_Banks1 (U2.B20)
SFP2_TD_N: SFP (J3.19), FPGA_Banks2 (U2.A6)
SFP2_TD_P: SFP (J3.18), FPGA_Banks2 (U2.B6)
SFP2_TX_EN: SFP (J4.3 R92.2), FPGA_Banks1 (U2.A19)
SFP2_TX_FAULT: SFP (J4.2 R91.2), FPGA_Banks1 (U2.A20)
SYSCLK: FPGA_Banks1 (U2.D17), FPGA_Banks2 (IC1.4)
VADJ: FPGA_PWR (25 pins), FMC (J1.G39 J1.H40), FPGA_Banks1 (R25.2), Regulators (R79.2), Config (R15.2)
VADJ_I_MON: FPGA_Banks1 (U2.J15), Regulators (Rout3.2 U12.1)
VCC1V0: PWR_APD5052 (5 pins), FPGA_PWR (25 pins), FPGA_Banks1 (R29.2)
VCC1V8: PWR_APD5052 (5 pins), FPGA_PWR (13 pins), FPGA_Banks1 (R27.2)
VCC2V5: PWR_APD5052 (C95.2 R72.2 U8.7), Regulators (Ren1.1)
VCC3V3: PWR_APD5052 (C76.2 R62.2 U8.8), FPGA_PWR (39 pins), SFP (20 pins), IO (16 pins), FMC (8 pins), FPGA_Banks1 (R23.2 R35.1 R36.1), FPGA_Banks2 (6 pins), Regulators (17 pins), Config (17 pins)
VCC12V0: PWR_APD5052 (12 pins), FMC (J1.C35 J1.C37), Regulators (7 pins)
VREF_A_M2C: FMC (J1.H1), FPGA_Banks2 (U2.E3)
XADC_1V8: FPGA_PWR (C49.2 U2.K10), Regulators (C113.1 R81.2 U15.5)
XADC_1V25: Regulators (C116.1 C117.1 U16.4), Config (C2.2 U2.M10)